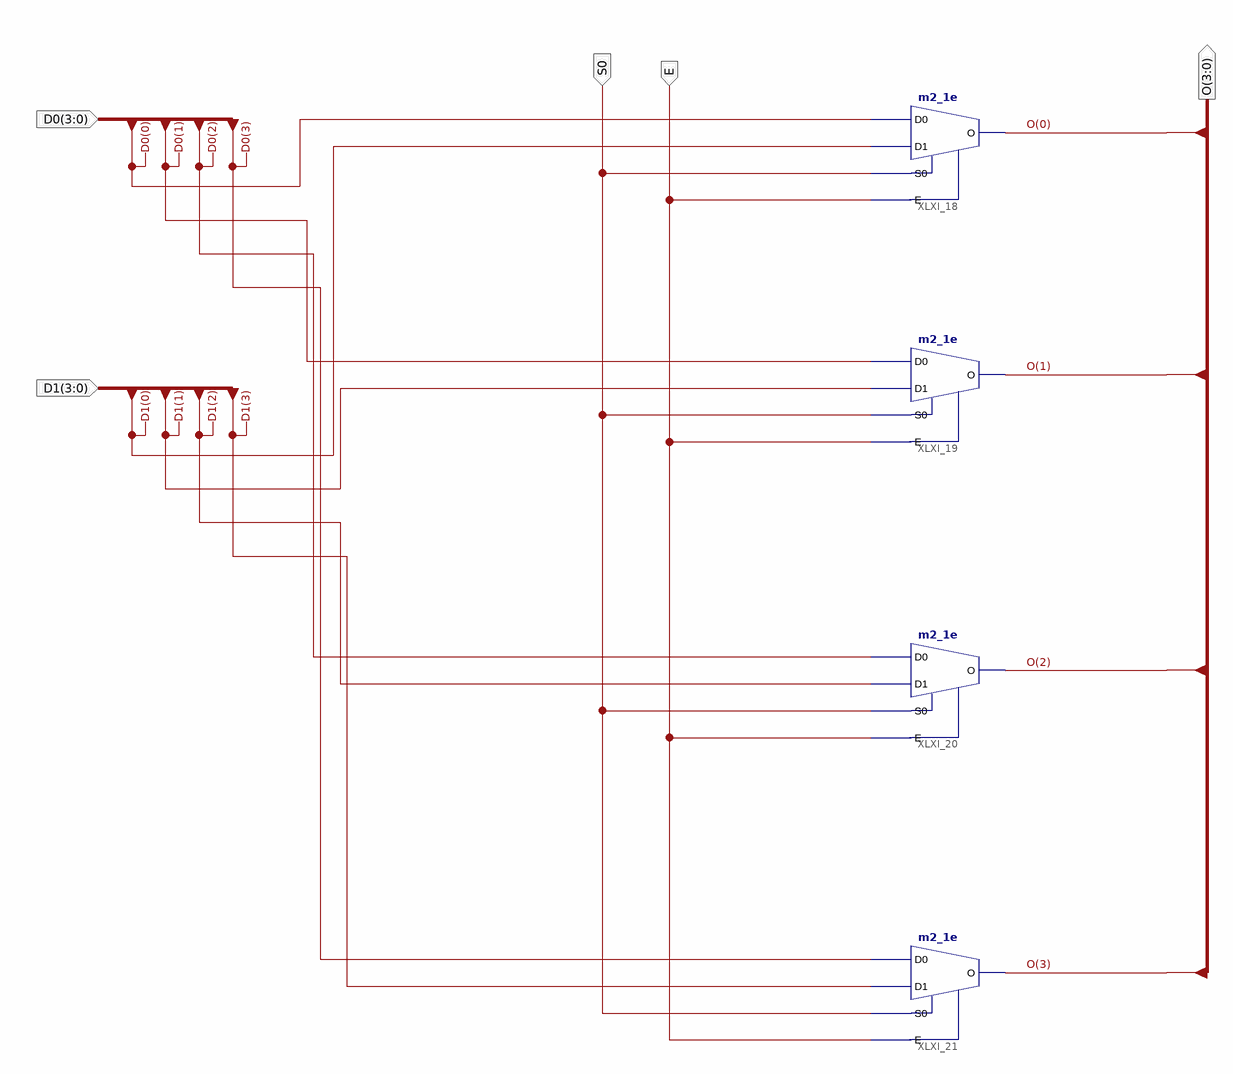
[diagram p0: schematic sheet 1]
// Xilinx ISE schematic Mux2_Bus4_1E.sch (spartan6) as structural Verilog: 4 symbols, 5 ports
module Mux2_Bus4_1E (
  input  [3:0] D0,
  input  [3:0] D1,
  input  S0,
  input  E,
  output [3:0] O
);

  m2_1e XLXI_18 (.D0(D0[0]), .D1(D1[0]), .E(E), .S0(S0), .O(O[0]));
  m2_1e XLXI_19 (.D0(D0[1]), .D1(D1[1]), .E(E), .S0(S0), .O(O[1]));
  m2_1e XLXI_20 (.D0(D0[2]), .D1(D1[2]), .E(E), .S0(S0), .O(O[2]));
  m2_1e XLXI_21 (.D0(D0[3]), .D1(D1[3]), .E(E), .S0(S0), .O(O[3]));
endmodule
